# Altium schematic sheet pinout_v2.SchDoc
size A
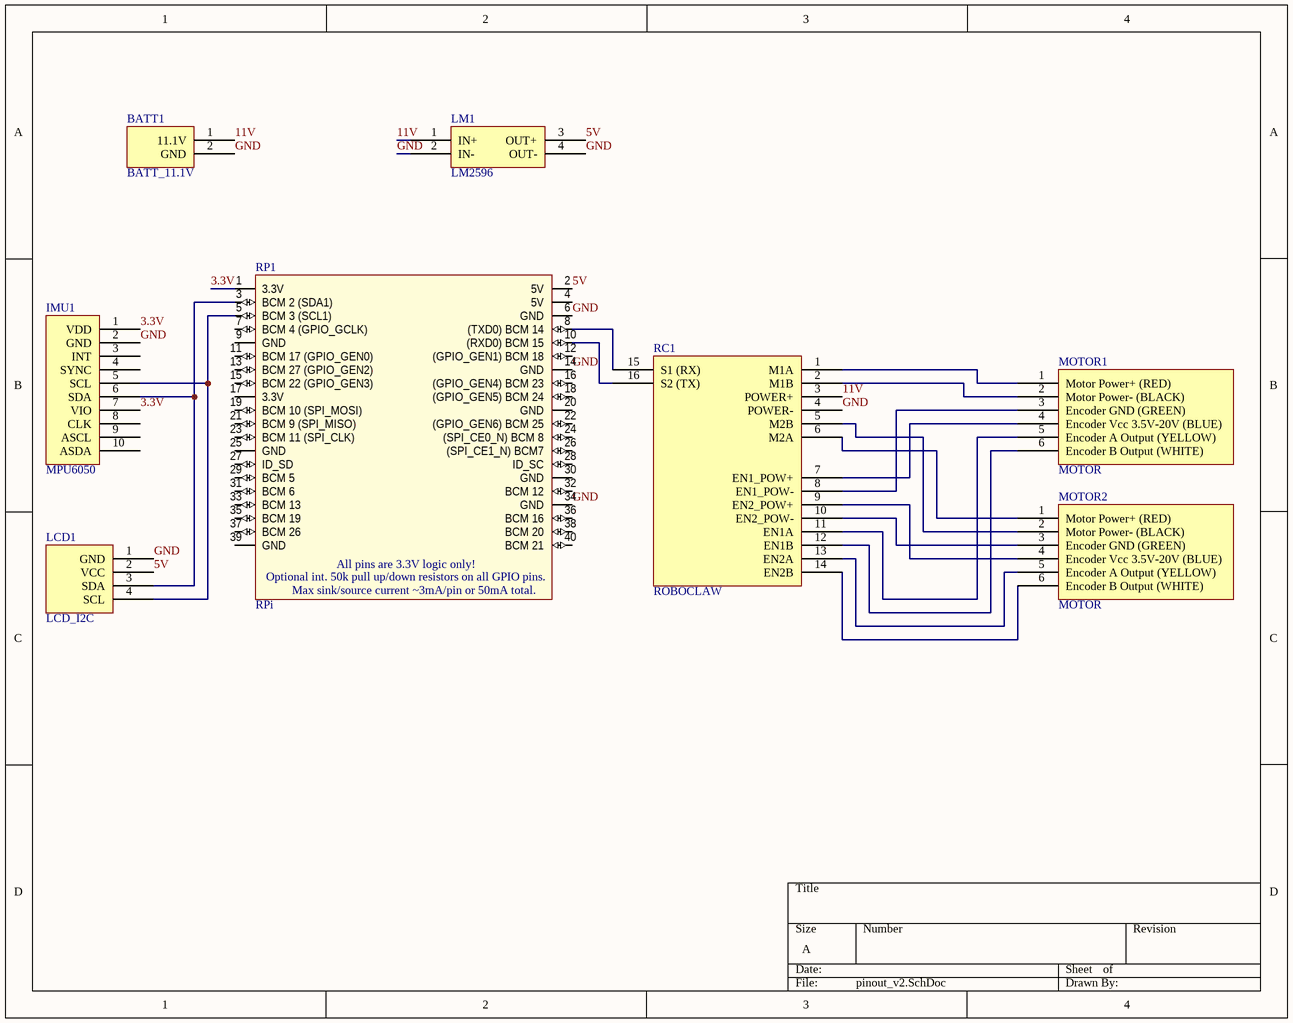
[diagram p0: pinout_v2.SchDoc]

## Parts
BATT1  BATT_11.1V
IMU1  MPU6050
LCD1  LCD_I2C
LM1  LM2596
MOTOR1  MOTOR
MOTOR2  MOTOR
RC1  ROBOCLAW
RP1  RPi  [40-Pin IDC Connector 2.54mm Pitch]

## Nets
3.3V: IMU1.1(VDD) IMU1.7(VIO) RP1.1(3.3V)
5V: LCD1.2(VCC) LM1.3(OUT+) RP1.2(5V)
11V: BATT1.1(11.1V) LM1.1(IN+) RC1.3(POWER+)
GND: BATT1.2(GND) IMU1.2(GND) LCD1.1(GND) LM1.2(IN-) LM1.4(OUT-) RC1.4(POWER-) RP1.6(GND) RP1.14(GND) RP1.34(GND)
NetIMU1_5: IMU1.5(SCL) LCD1.4(SCL) RP1.5(BCM_3_(SCL1))
NetIMU1_6: IMU1.6(SDA) LCD1.3(SDA) RP1.3(BCM_2_(SDA1))
NetMOTOR1_1: MOTOR1.1(Motor_Power+_(RED)) RC1.1(M1A)
NetMOTOR1_2: MOTOR1.2(Motor_Power-_(BLACK)) RC1.2(M1B)
NetMOTOR1_3: MOTOR1.3(Encoder_GND_(GREEN)) RC1.8(EN1_POW-)
NetMOTOR1_4: MOTOR1.4(Encoder_Vcc_3.5V-20V_(BLUE)) RC1.7(EN1_POW+)
NetMOTOR1_5: MOTOR1.5(Encoder_A_Output_(YELLOW)) RC1.11(EN1A)
NetMOTOR1_6: MOTOR1.6(Encoder_B_Output_(WHITE)) RC1.12(EN1B)
NetMOTOR2_1: MOTOR2.1(Motor_Power+_(RED)) RC1.6(M2A)
NetMOTOR2_2: MOTOR2.2(Motor_Power-_(BLACK)) RC1.5(M2B)
NetMOTOR2_3: MOTOR2.3(Encoder_GND_(GREEN)) RC1.10(EN2_POW-)
NetMOTOR2_4: MOTOR2.4(Encoder_Vcc_3.5V-20V_(BLUE)) RC1.9(EN2_POW+)
NetMOTOR2_5: MOTOR2.5(Encoder_A_Output_(YELLOW)) RC1.13(EN2A)
NetMOTOR2_6: MOTOR2.6(Encoder_B_Output_(WHITE)) RC1.14(EN2B)
NetRC1_15: RC1.15(S1_(RX)) RP1.8((TXD0)_BCM_14)
NetRC1_16: RC1.16(S2_(TX)) RP1.10((RXD0)_BCM_15)

Not connected (* = marked no-connect by the designer): IMU1 3(INT) 4(SYNC) 8(CLK) 9(ASCL) 10(ASDA); RP1 4(5V) 7(BCM_4_(GPIO_GCLK)) 9(GND) 11(BCM_17_(GPIO_GEN0)) 12((GPIO_GEN1)_BCM_18) 13(BCM_27_(GPIO_GEN2)) 15(BCM_22_(GPIO_GEN3)) 16((GPIO_GEN4)_BCM_23) 17(3.3V) 18((GPIO_GEN5)_BCM_24) 19(BCM_10_(SPI_MOSI)) 20(GND) 21(BCM_9_(SPI_MISO)) 22((GPIO_GEN6)_BCM_25) 23(BCM_11_(SPI_CLK)) 24((SPI_CE0_N)_BCM_8) 25(GND) 26((SPI_CE1_N)_BCM7) 27(ID_SD) 28(ID_SC) 29(BCM_5) 30(GND) 31(BCM_6) 32(BCM_12) 33(BCM_13) 35(BCM_19) 36(BCM_16) 37(BCM_26) 38(BCM_20) 39(GND) 40(BCM_21)

## Notes on the sheet
- (in symbol RPi) All pins are 3.3V logic only!; Optional int. 50k pull up/down resistors on all GPIO pins.; Max sink/source current ~3mA/pin or 50mA total.

## Library data of the parts
BATT1 = BATT_11.1V: 11.1V, 4000mAh, 40C 3S LiPo Battery
IMU1 = MPU6050: SparkFun Triple Axis Accelerometer and Gyro Breakout
LCD1 = LCD_I2C: LCD with I2C communication
LM1 = LM2596: DZS Elec 2PCS LM2596 DC-DC Step Down Variable Volt Regulator Input 3.2V-40V Output 1.25V-35V Adjustable Buck Converter Electronic Voltage Stabilizer Power Supply Module
MOTOR1 MOTOR2 = MOTOR: 30:1 Metal Gearmotor 37Dx68L mm with 64 CPR Encoder
RC1 = ROBOCLAW: RoboClaw 2x7A Motor Controller (V5C)
RP1 = RPi: 40-pin IDC 2.54mm P Header with RPi 2+ GPIO pinout; Connector Manufacturer: TE Connectivity; RPi GPIO Pinout: https://pinout.xyz/; Connector Datasheet: http://www.mouser.com/ds/2/418/NG_CD_1761603_B1-619330.pdf; Mouser Part #: 571-3-1761603-3; Adafruit Cable: https://www.adafruit.com/product/1988